# EAGLE schematic Oscillator_FOX_924B (EAGLE 6.5.0)
Oscillator: FOX924B 16MHz FOX924B <http://www.foxonline.com/pdfs/fox924.pdf>
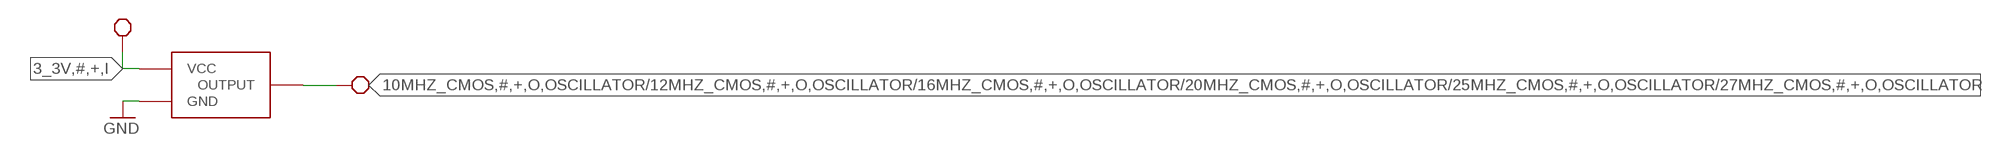
[diagram p0: schematic, sheet 1]

## Parts
OSC1  FOX924B  [4-SMD_5X3.2]

## Nets
3_3V,#,+,I: OSC1.P$4(VCC) ; supply symbol labelled BLOCK_REQUIREMENT
10MHZ_CMOS,#,+,O,OSCILLATOR/12MHZ_CMOS,#,+,O,OSCILLATOR/16MHZ_CMOS,#,+,O,OSCILLATOR/20MHZ_CMOS,#,+,O,OSCILLATOR/25MHZ_CMOS,#,+,O,OSCILLATOR/27MHZ_CMOS,#,+,O,OSCILLATOR: OSC1.P$3(OUTPUT) ; supply symbol labelled BLOCK_REQUIREMENT
GND: OSC1.P$2(GND)

## Library data of the parts
OSC1 = piccoli:FOX924B